# Altium schematic sheet JTAG.SchDoc
size A4
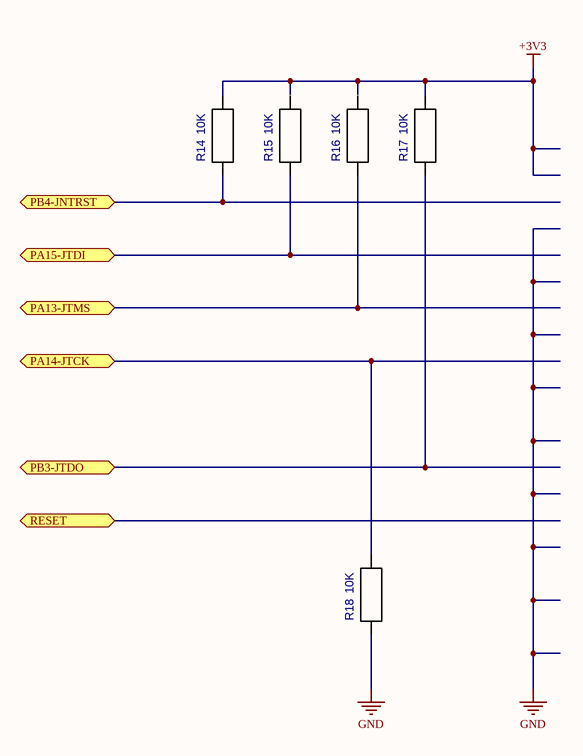
[diagram p0: JTAG.SchDoc]

## Parts
R14  10K  [RES_0805]
R15  10K  [RES_0805]
R16  10K  [RES_0805]
R17  10K  [RES_0805]
R18  10K  [RES_0805]

## Ports
PA13-JTMS (bidir), PA14-JTCK (bidir), PA15-JTDI (bidir), PB3-JTDO (bidir), PB4-JNTRST (bidir), RESET (bidir)

## Nets
+3V3: R14.1 R17.1
GND: R18.2
PA13-JTMS: R16.2 ; port PA13-JTMS
PA14-JTCK: R18.1 ; port PA14-JTCK
PA15-JTDI: R15.2 ; port PA15-JTDI
PB3-JTDO: R17.2 ; port PB3-JTDO
PB4-JNTRST: R14.2 ; port PB4-JNTRST

Not connected (* = marked no-connect by the designer): R15 1; R16 1

## Library data of the parts
R14-R18 = RES_0805: Value: *